# EAGLE design power_shield (EAGLE 7.2.0)
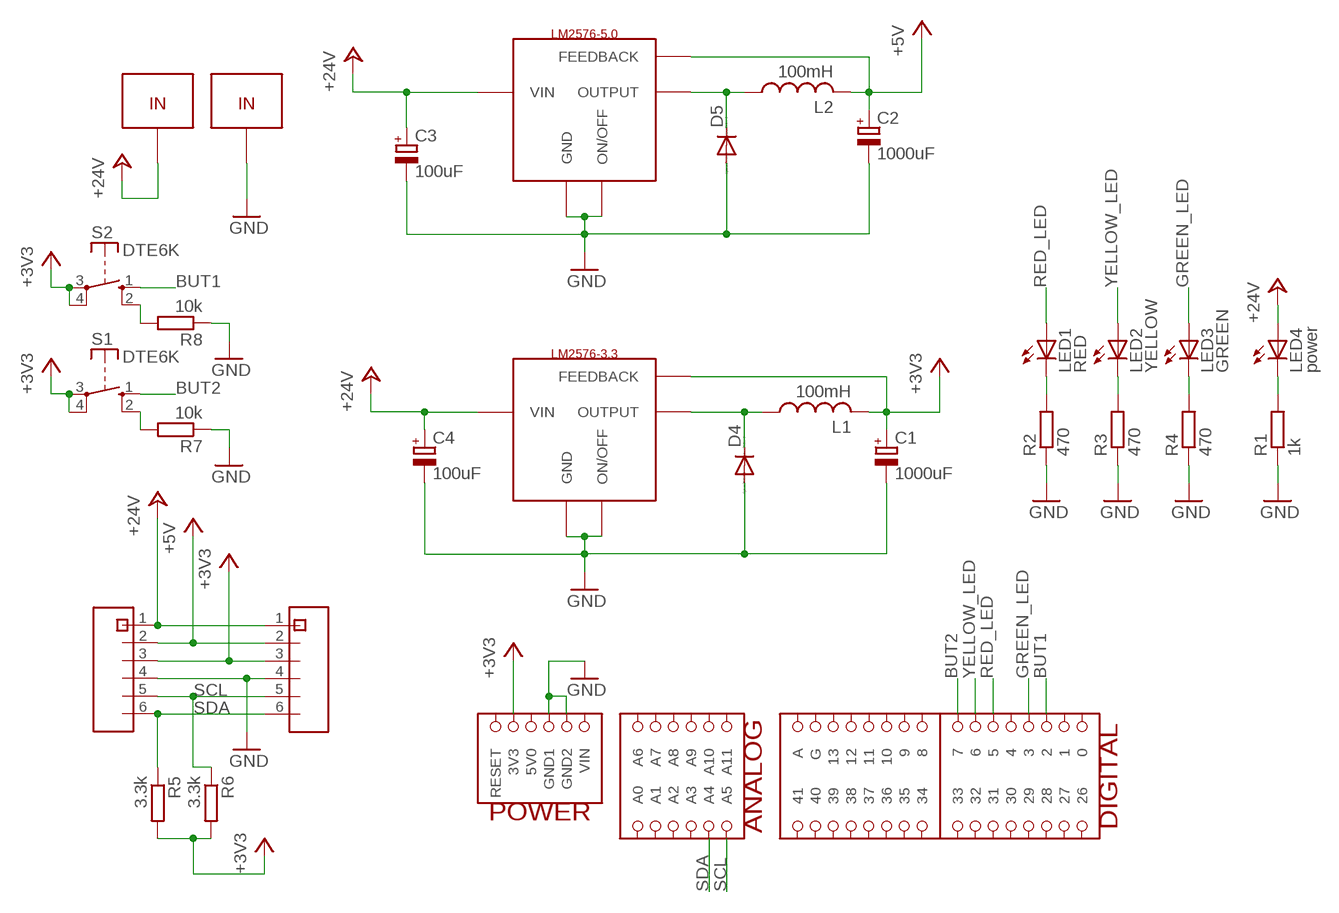
[diagram p0: schematic, sheet 1]

## Parts
C1  1000uF  CPOL-EU150CLZ-1010  [150CLZ-1010]
C2  1000uF  CPOL-EU150CLZ-1010  [150CLZ-1010]
C3  100uF  CPOL-EU150CLZ-1010  [150CLZ-1010]
C4  100uF  CPOL-EU150CLZ-1010  [150CLZ-1010]
D4  DIODE-DO214AA  [DO214AA]
D5  DIODE-DO214AA  [DO214AA]
L1  100mH  L-US6000-XXX-RC  [6000-XXXX-RC]
L2  100mH  L-US6000-XXX-RC  [6000-XXXX-RC]
LED1  RED  LEDCHIPLED_1206  [CHIPLED_1206]
LED2  YELLOW  LEDCHIPLED_1206  [CHIPLED_1206]
LED3  GREEN  LEDCHIPLED_1206  [CHIPLED_1206]
LED4  power  LEDCHIPLED_1206  [CHIPLED_1206]
R1  1k  R-EU_R0603  [R0603]
R2  470  R-EU_R0603  [R0603]
R3  470  R-EU_R0603  [R0603]
R4  470  R-EU_R0603  [R0603]
R5  3.3k  R-EU_R0603  [R0603]
R6  3.3k  R-EU_R0603  [R0603]
R7  10k  R-EU_R0603  [R0603]
R8  10k  R-EU_R0603  [R0603]
S1  DTE6K  [DTE6K]
S2  DTE6K  [DTE6K]
U$1  UNO32_SHIELD  [UNO32_SHIELD]
U$2  LM2576-5.0  [TO-220-5]
U$3  LM2576-3.3  [TO-220-5]
U$4  MOLEX_3.96MM_6P  [MOLEX_3.96MM_6P]
U$5  MOLEX_3.96MM_6P  [MOLEX_3.96MM_6P]
U$6  LABBHYLSA  [LABBHYLSA]
U$7  LABBHYLSA  [LABBHYLSA]

## Nets
+3V3: C1.+ L1.2 R5.2 R6.2 S1.3(P) S1.4(P) S2.3(P) S2.4(P) U$1.3V3 U$3.4(FEEDBACK) U$4.3 U$5.3
+5V: C2.+ L2.2 U$2.4(FEEDBACK) U$4.2 U$5.2
+24V: C3.+ C4.+ LED4.A U$2.1(VIN) U$3.1(VIN) U$4.1 U$5.1 U$6.IN U$6.IN2(IN)
BUT1: S2.1(S) U$1.2
BUT2: S1.1(S) U$1.7
GND: C1.- C2.- C3.- C4.- D4.A D5.A R1.1 R2.1 R3.1 R4.1 R7.1 R8.1 U$1.GND1 U$1.GND2 U$2.3(GND) U$2.5(ON/OFF) U$3.3(GND) U$3.5(ON/OFF) U$4.4 U$5.4 U$7.IN U$7.IN2(IN)
GREEN_LED: LED3.A U$1.3
N$1: LED4.C R1.2
N$2: D5.C L2.1 U$2.2(OUTPUT)
N$3: LED1.C R2.2
N$4: LED2.C R3.2
N$5: D4.C L1.1 U$3.2(OUTPUT)
N$6: LED3.C R4.2
N$7: R7.2 S1.2(S)
N$8: R8.2 S2.2(S)
RED_LED: LED1.A U$1.5
SCL: R6.1 U$1.A5 U$4.5 U$5.5
SDA: R5.1 U$1.A4 U$4.6 U$5.6
YELLOW_LED: LED2.A U$1.6
Unconnected: U$1.0 U$1.1 U$1.4 U$1.5V0 U$1.8 U$1.9 U$1.10 U$1.11 U$1.12 U$1.13 U$1.26 U$1.27 U$1.28 U$1.29 U$1.30 U$1.31 U$1.32 U$1.33 U$1.34 U$1.35 U$1.36 U$1.37 U$1.38 U$1.39 U$1.40 U$1.41 U$1.A U$1.A0 U$1.A1 U$1.A2 U$1.A3 U$1.A6 U$1.A7 U$1.A8 U$1.A9 U$1.A10 U$1.A11 U$1.G U$1.RESET U$1.VIN

## Library data of the parts
C1-C4 = rcl:CPOL-EU: POLARIZED CAPACITOR, European symbol
D4 D5 = diode:DIODE-: DIODE
L1 L2 = rcl:L-US: INDUCTOR, American symbol
LED1-LED4 = led:LED: LED OSRAM: - CHIPLED LG R971, LG N971, LY N971, LG Q971, LY Q971, LO R971, LY R971 LH N974, LH R974 LS Q976, LO Q976, LY Q976 LO Q996 - Hyper CHIPLED LW Q18S LB Q993, LB Q99A, LB R99A - SideLED LS A670, LO A670, LY A670, LG A670, LP A670 LB A673, LV A673, LT A673, LW A673 LH A674 LY A675 LS A676, LA A676, LO A676, LY A676, LW A676 LS A679, LY A679, LG A679 - Hyper Micro SIDELED® LS Y876, LA Y876, LO Y876, LY Y876 LT Y87S - SmartLED LW L88C, LW L88S LB L89C, LB L89S, LG L890 LS L89K, LO L89K, LY L89K LS L896, LA L896, LO L896, LY L896 - TOPLED LS T670, LO T670, LY T670, LG T670, LP T670 LSG T670, LSP T670, LSY T670, LOP T670, LYG T670 LG T671, LOG T671, LSG T671 LB T673, LV T673, LT T673, LW T673 LH T674 LS T676, LA T676, LO T676, LY T676, LB T676, LH T676, LSB T676, LW T676 LB T67C, LV T67C, LT T67C, LS T67K, LO T67K, LY T67K, LW E67C LS E67B, LA E67B, LO E67B, LY E67B, LB E67C, LV E67C, LT E67C LW T67C LS T679, LY T679, LG T679 LS T770, LO T770, LY T770, LG T770, LP T770 LB T773, LV T773, LT T773, LW T773 LH T774 LS E675, LA E675, LY E675, LS T675 LS T776, LA T776, LO T776, LY T776, LB T776 LHGB T686 LT T68C, LB T68C - Hyper Mini TOPLED® LB M676 - Mini TOPLED Santana® LG M470 LS M47K, LO M47K, LY M47K Source: http://www.osram.convergy.de LUXEON: - LUMILED® LXK2-PW12-R00, LXK2-PW12-S00, LXK2-PW14-U00, LXK2-PW14-V00 LXK2-PM12-R00, LXK2-PM12-S00, LXK2-PM14-U00 LXK2-PE12-Q00, LXK2-PE12-R00, LXK2-PE12-S00, LXK2-PE14-T00, LXK2-PE14-U00 LXK2-PB12-K00, LXK2-PB12-L00, LXK2-PB12-M00, LXK2-PB14-N00, LXK2-PB14-P00, LXK2-PB14-Q00 LXK2-PR12-L00, LXK2-PR12-M00, LXK2-PR14-Q00, LXK2-PR14-R00 LXK2-PD12-Q00, LXK2-PD12-R00, LXK2-PD12-S00 LXK2-PH12-R00, LXK2-PH12-S00 LXK2-PL12-P00, LXK2-PL12-Q00, LXK2-PL12-R00 Source: www.luxeon.com KINGBRIGHT: KA-3528ASYC Source: www.kingbright.com
R1-R8 = resistor:R-EU_: RESISTOR, European symbol
S1 S2 = switch-misc:DT: ITT SWITCH
U$1 = mylib:UNO32_SHIELD: UNO32 shield Arduino type shield for the chipkit uno32
U$2 = mylib:LM2576-5.0
U$3 = mylib:LM2576-3.3
U$4 U$5 = mylib:MOLEX_3.96MM_6P: A 6 pin molex connector with raster 3.96mm
U$6 U$7 = mylib:LABBHYLSA: Kontakt for 4mm labbkabel

## Board
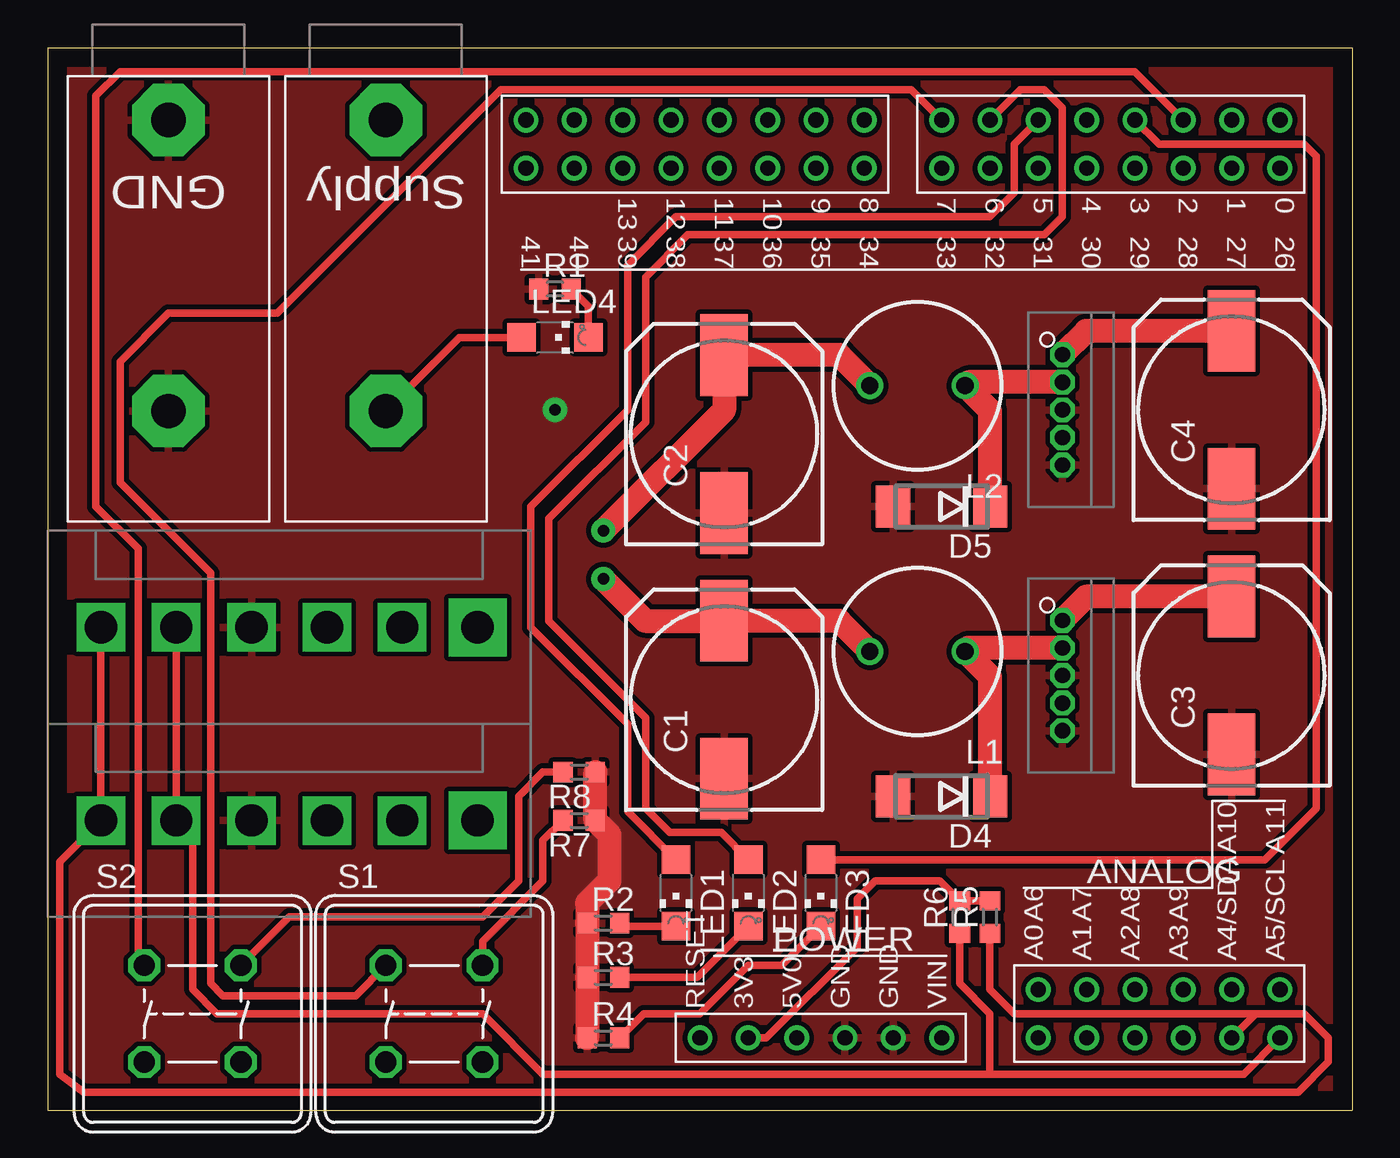
[diagram p1: board, top side]
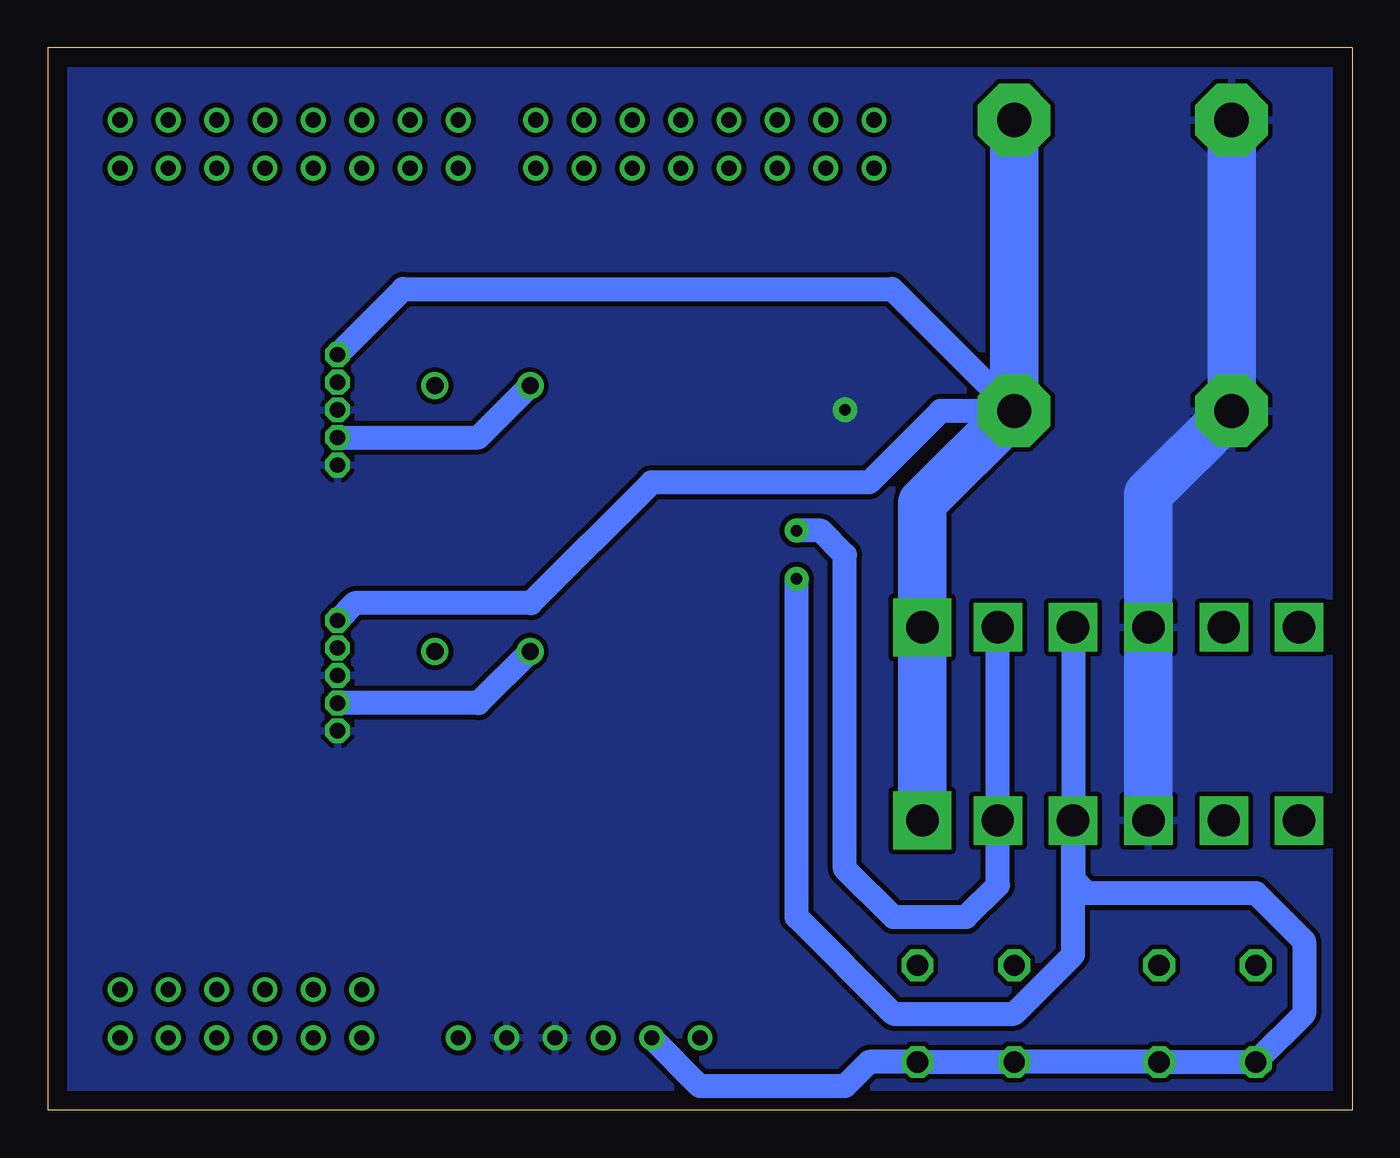
[diagram p2: board, bottom side, seen from below]

Size 68.58 x 55.88 mm. Coordinates in mm from the lower left corner, seen from the top.
Outline: 0,55.87 0,0 68.58,0 68.58,55.88 0,55.88
Copper layers (1*16): Top 0.035mm / dielectric 1.5mm / Bottom 0.035mm
Design rules "default *": minimum track width 10mil, minimum drill 24mil, track to track 10mil, track to pad 10mil, pad to pad 8mil, via to via 8mil, smd to smd 8mil, copper to edge 40mil, drill to drill 8mil, minimum pad ring 10mil, minimum via ring 8mil, stop-mask expansion 4mil, vias tented up to drill 0mil, thermal gap 10mil

### Footprints (pad centres in the part's own frame; a part is rotated, then mirrored left to right if it is on the bottom)
150CLZ-1010 = smd 4.3 x 2.5: + 4.15,0; - -4.15,0
DO214AA = smd 1.8 x 2.2: A 2.55,0; C -2.55,0
6000-XXXX-RC = drill 0.9 pad 1.422: 1 -2.5,0; 2 2.5,0
CHIPLED_1206 = smd 1.5 x 1.5: A 0,-1.75; C 0,1.75
R0603 = smd 1 x 1.1: 1 -0.85,0; 2 0.85,0
DTE6K = drill 1.118 octagon: 1 -2.54,2.54; 2 2.54,2.54; 3 2.54,-2.54; 4 -2.54,-2.54
UNO32_SHIELD = drill 0.8: 0 0,48.26; 1 -2.54,48.26; 2 -5.08,48.26; 3 -7.62,48.26; 3V3 -27.94,0; 4 -10.16,48.26; 5 -12.7,48.26; 5V0 -25.4,0; 6 -15.24,48.26; 7 -17.78,48.26; 8 -21.844,48.26; 9 -24.384,48.26; 10 -26.924,48.26; 11 -29.464,48.26; 12 -32.004,48.26; 13 -34.544,48.26; 26 0,45.72; 27 -2.54,45.72; 28 -5.08,45.72; 29 -7.62,45.72; 30 -10.16,45.72; 31 -12.7,45.72; 32 -15.24,45.72; 33 -17.78,45.72; 34 -21.844,45.72; 35 -24.384,45.72; 36 -26.924,45.72; 37 -29.464,45.72; 38 -32.004,45.72; 39 -34.544,45.72; 40 -37.084,45.72; 41 -39.624,45.72; A -39.624,48.26; A0 -12.7,0; A1 -10.16,0; A2 -7.62,0; A3 -5.08,0; A4 -2.54,0; A5 0,0; A6 -12.7,2.54; A7 -10.16,2.54; A8 -7.62,2.54; A9 -5.08,2.54; A10 -2.54,2.54; A11 0,2.54; G -37.084,48.26; GND1 -22.86,0; GND2 -20.32,0; RESET -30.48,0; VIN -17.78,0
TO-220-5 = drill 0.8 pad 1.27 octagon: 1 0,2.9; 2 0,1.45; 3 0,0; 4 0,-1.45; 5 0,-2.9
MOLEX_3.96MM_6P = drill 1.7 pad 3.048 square: 1 0,9.9 | drill 1.7 pad 2.54 square: 2 0,5.94; 3 0,1.98; 4 0,-1.98; 5 0,-5.94; 6 0,-9.9
LABBHYLSA = drill 1.8 pad 3.81 octagon: IN 0,0; IN2 0,15.3

### Placement (x,y rotation side)
C1  35.56,21.59 90 top
C2  35.56,35.56 90 top
C3  62.23,22.86 90 top
C4  62.23,36.83 90 top
D4  46.99,16.51 180 top
D5  46.99,31.75 180 top
L1  45.72,24.13 180 top
L2  45.72,38.1 180 top
LED1  33.02,11.43 180 top
LED2  36.83,11.43 180 top
LED3  40.64,11.43 180 top
LED4  26.67,40.64 270 top
R1  26.67,43.18 0 top
R2  29.21,9.84 0 top
R3  29.21,6.99 0 top
R4  29.21,3.81 0 top
R5  49.53,10.16 90 top
R6  47.94,10.16 90 top
R7  27.94,15.24 180 top
R8  27.94,17.78 180 top
S1  20.32,5.08 0 top
S2  7.62,5.08 0 top
U$1  64.77,3.81 0 top
U$2  53.34,36.83 0 top
U$3  53.34,22.86 0 top
U$4  12.7,15.24 270 top
U$5  12.7,25.4 270 top
U$6  17.78,52.07 180 top
U$7  6.35,52.07 180 top

### Tracks (layer width: path | path; a pad name or v marks a point on that pad's centre or on a via)
+3V3  (via drill 0.6 pad 1.27)
  Top 0.406: R5.2 R6.2 46.89,12.06 43.5,12.06 42.55,11.11 42.55,8.57 37.78,3.81 U$1.3V3
  Top 1.27: L1.2 41.61,25.74 C1.+ 31.41,25.74 v29.21,27.94
  Bottom 1.27: U$5.3 U$4.3 | U$4.3 14.68,12.14 13.97,11.43 5.08,11.43 2.54,8.89 2.54,5.08 S2.4 S2.3 S1.4 S1.3 25.4,2.54 26.67,1.27 34.29,1.27 U$1.3V3 | L1.2 45.94,21.41 U$3.4 | U$4.3 14.68,8.18 17.78,5.08 24.13,5.08 29.21,10.16 v29.21,27.94
+5V  (via drill 0.6 pad 1.27)
  Top 1.27: L2.2 41.61,39.71 C2.+ 35.56,36.83 v29.21,30.48
  Bottom 1.27: U$2.4 45.94,35.38 L2.2 | U$5.2 U$4.2 18.64,11.84 20.32,10.16 24.13,10.16 26.67,12.7 26.67,29.21 27.94,30.48 v29.21,30.48
+24V
  Top 0.406: U$6.IN2 21.65,40.64 LED4.A
  Top 1.27: C4.+ 54.59,40.98 U$2.1 | C3.+ 54.59,27.01 U$3.1
  Bottom 1.27: U$2.1 49.89,43.18 24.19,43.18 U$6.IN2 21.65,36.77 25.4,33.02 36.83,33.02 43.18,26.67 52.43,26.67 U$3.1
  Bottom 2.54: U$6.IN U$6.IN2 22.6,31.95 U$5.1 U$4.1
BUT1
  Top 0.406: S2.1 4.76,7.94 4.76,29.53 2.54,31.75 2.54,53.34 3.81,54.61 57.15,54.61 U$1.2
BUT2
  Top 0.406: S1.1 16.19,6.03 9.21,6.03 8.57,6.67 8.57,28.26 3.81,33.02 3.81,39.37 6.35,41.91 12.06,41.91 23.81,53.66 45.4,53.66 U$1.7
GND  (via drill 0.6 pad 1.27)
  Top 1.27: R8.1 R7.1 29.53,14.5 29.53,12.06 28.36,10.9 R2.1 R3.1 R4.1
  Bottom 2.54: U$7.IN U$7.IN2 10.72,32.4 U$5.4 U$4.4
  other vias: 26.67,36.83
  pour Top: 0,55.88 68.58,55.88 68.58,0 0,0
  pour Bottom: 0,55.88 68.58,55.88 68.58,0 0,0
GREEN_LED
  Top 0.406: LED3.A 63.98,13.18 66.67,15.88 66.67,50.16 66.04,50.8 58.42,50.8 U$1.3
N$1
  Top 0.406: LED4.C 28.42,42.28 R1.2
N$2
  Top 1.27: U$2.2 48.4,38.28 L2.1 49.54,36.78 D5.C
N$3
  Top 0.406: LED1.C 30.22,9.68 R2.2
N$4
  Top 0.406: LED2.C 34.13,6.99 R3.2
N$5
  Top 1.27: U$3.2 48.4,24.31 L1.1 49.54,22.81 D4.C
N$6
  Top 0.406: LED3.C 38.58,7.62 36.83,7.62 34.29,5.08 31.33,5.08 R4.2
N$7
  Top 0.406: S1.2 22.86,8.89 26.04,12.06 26.04,14.19 R7.2
N$8
  Top 0.406: S2.2 12.7,10.16 22.86,10.16 24.77,12.06 24.77,16.51 26.04,17.78 R8.2
N$9
  pour Top: 0,55.88 68.58,55.88 68.58,0 0,0
N$10
  pour Bottom: 0,55.88 68.58,55.88 68.58,0 0,0
RED_LED
  Top 0.406: U$1.5 50.8,50.8 50.8,48.26 49.53,46.99 33.02,46.99 30.48,44.45 30.48,36.83 25.4,31.75 25.4,25.4 30.48,20.32 30.48,15.72 LED1.A
SCL
  Top 0.406: U$5.5 U$4.5 7.62,14.38 7.62,6.35 8.89,5.08 22.86,5.08 26.04,1.91 49.53,1.91 | 49.53,1.91 62.87,1.91 U$1.A5 | R6.1 47.94,6.67 49.53,5.08 49.53,1.91
SDA
  Top 0.406: U$5.6 U$4.6 0.64,13.07 0.64,1.91 1.91,0.95 65.72,0.95 67.31,2.54 67.31,3.81 66.04,5.08 63.5,5.08 | 63.5,5.08 U$1.A4 | R5.1 49.53,6.35 50.8,5.08 63.5,5.08
YELLOW_LED
  Top 0.406: U$1.6 51.12,53.66 52.39,53.66 53.34,52.7 53.34,46.99 52.39,46.04 33.66,46.04 31.43,43.81 31.43,36.2 26.35,31.11 26.35,25.72 31.43,20.64 31.43,15.88 32.7,14.61 35.41,14.61 LED2.A

### Text on the board
tPlace: GND | Supply